# Altium schematic sheet 00-Block_Diagram.SchDoc: Block Diagram
size A4; CheckedBy: Juan M Garin; Author: Juan M Garin; CompanyName: ESO; DrawnBy: Juan M Garin; Engineer: Juan M Garin; Organization: ESO; Address1: Juan M Garin; DocumentNumber: 0; Revision: 1.0; SheetNumber: 0; SheetTotal: 6; ProjectName: Central Controller
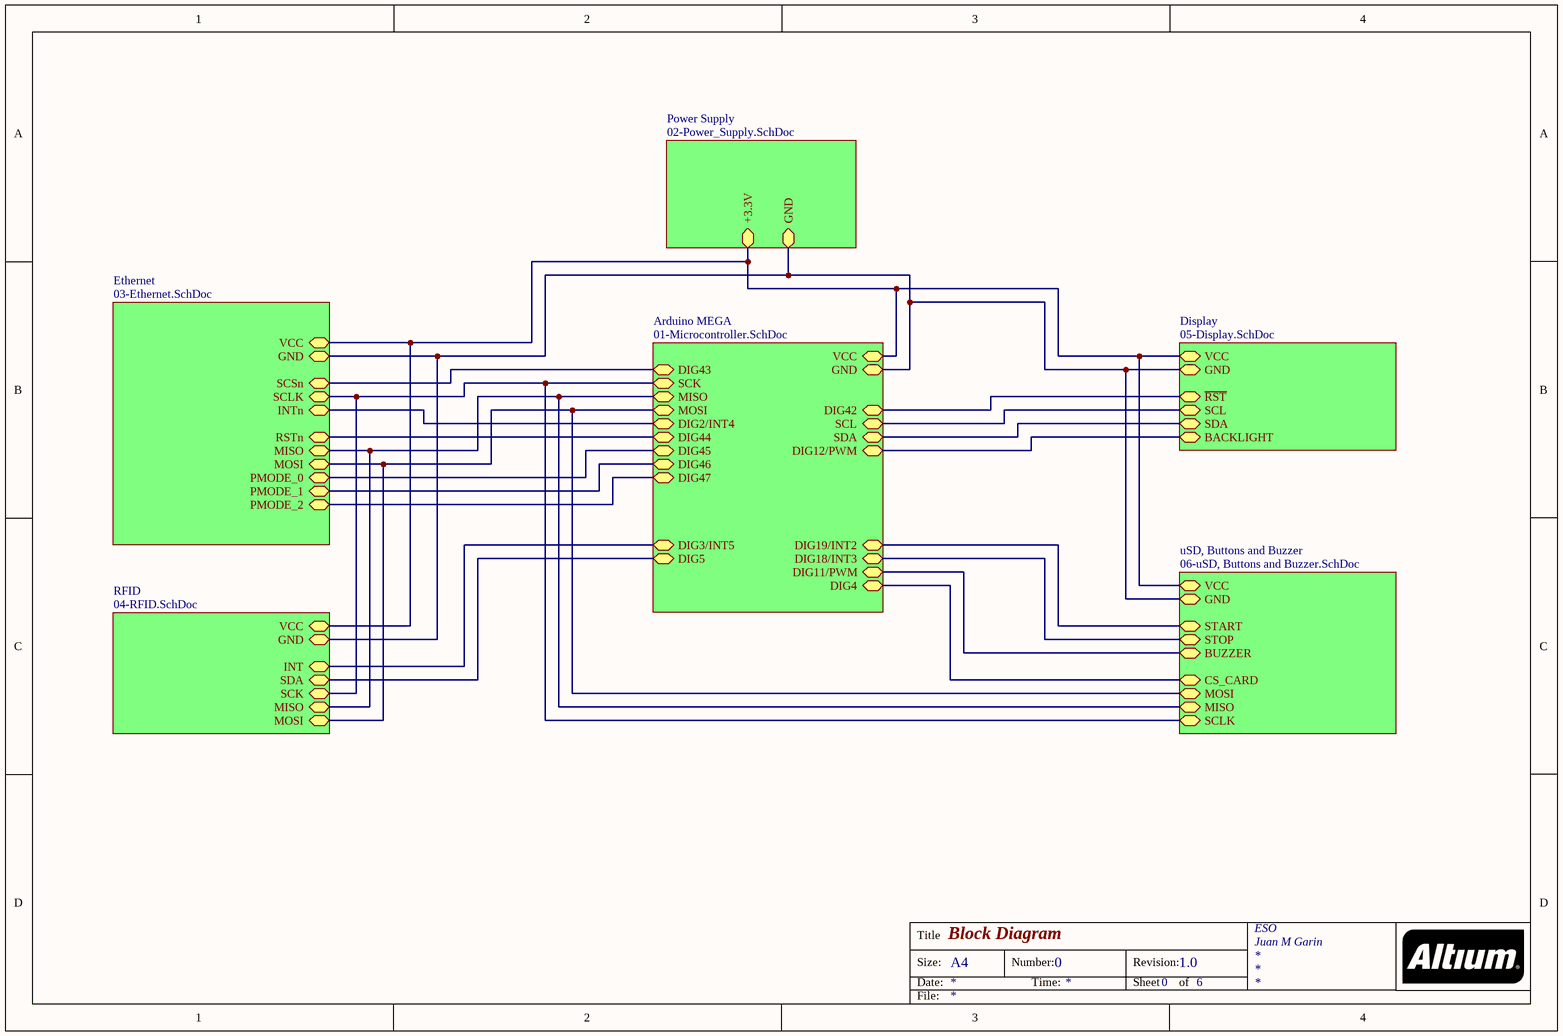
[diagram p0: 00-Block_Diagram.SchDoc]

## Sub-sheets
Arduino MEGA = 01-Microcontroller.SchDoc: GND, VCC, SCK, MISO, MOSI, DIG4, DIG43, DIG2/INT4, DIG44, DIG19/INT2, DIG18/INT3, DIG11/PWM, DIG42, SCL, SDA, DIG12/PWM, DIG3/INT5, DIG5, DIG45, DIG46, DIG47
Display = 05-Display.SchDoc: SDA, SCL, ~{RST}, GND, VCC, BACKLIGHT
Ethernet = 03-Ethernet.SchDoc: GND, SCSn, VCC, SCLK, INTn, PMODE_1, PMODE_2, RSTn, MISO, MOSI, PMODE_0
Power Supply = 02-Power_Supply.SchDoc: GND, +3.3V
RFID = 04-RFID.SchDoc: GND, VCC, INT, MISO, MOSI, SDA, SCK
uSD, Buttons and Buzzer = 06-uSD, Buttons and Buzzer.SchDoc: GND, VCC, START, STOP, BUZZER, CS_CARD, MOSI, MISO, SCLK

## Nets
(unnamed): sheet Ethernet/GND, sheet Power Supply/GND, sheet Arduino MEGA/GND, sheet uSD, Buttons and Buzzer/GND, sheet RFID/GND, sheet Display/GND
(unnamed): sheet Ethernet/SCSn, sheet Arduino MEGA/DIG43
(unnamed): sheet Ethernet/VCC, sheet Power Supply/+3.3V, sheet Arduino MEGA/VCC, sheet uSD, Buttons and Buzzer/VCC, sheet RFID/VCC, sheet Display/VCC
(unnamed): sheet Ethernet/SCLK, sheet Arduino MEGA/SCK, sheet uSD, Buttons and Buzzer/SCLK, sheet RFID/SCK
(unnamed): sheet Ethernet/INTn, sheet Arduino MEGA/DIG2/INT4
(unnamed): sheet Ethernet/PMODE_1, sheet Arduino MEGA/DIG46
(unnamed): sheet Ethernet/PMODE_2, sheet Arduino MEGA/DIG47
(unnamed): sheet Ethernet/RSTn, sheet Arduino MEGA/DIG44
(unnamed): sheet Ethernet/MISO, sheet Arduino MEGA/MISO, sheet uSD, Buttons and Buzzer/MISO, sheet RFID/MISO
(unnamed): sheet Ethernet/MOSI, sheet Arduino MEGA/MOSI, sheet uSD, Buttons and Buzzer/MOSI, sheet RFID/MOSI
(unnamed): sheet Ethernet/PMODE_0, sheet Arduino MEGA/DIG45
(unnamed): sheet Arduino MEGA/DIG4, sheet uSD, Buttons and Buzzer/CS_CARD
(unnamed): sheet Arduino MEGA/DIG19/INT2, sheet uSD, Buttons and Buzzer/START
(unnamed): sheet Arduino MEGA/DIG18/INT3, sheet uSD, Buttons and Buzzer/STOP
(unnamed): sheet Arduino MEGA/DIG11/PWM, sheet uSD, Buttons and Buzzer/BUZZER
(unnamed): sheet Arduino MEGA/DIG42, sheet Display/~{RST}
(unnamed): sheet Arduino MEGA/SCL, sheet Display/SCL
(unnamed): sheet Arduino MEGA/SDA, sheet Display/SDA
(unnamed): sheet Arduino MEGA/DIG12/PWM, sheet Display/BACKLIGHT
(unnamed): sheet Arduino MEGA/DIG3/INT5, sheet RFID/INT
(unnamed): sheet Arduino MEGA/DIG5, sheet RFID/SDA

## Notes on the sheet
- Title
- Size:
- Date:
- A4
- Number:
- Time:
- Revision:
- Sheet
- of
- File: